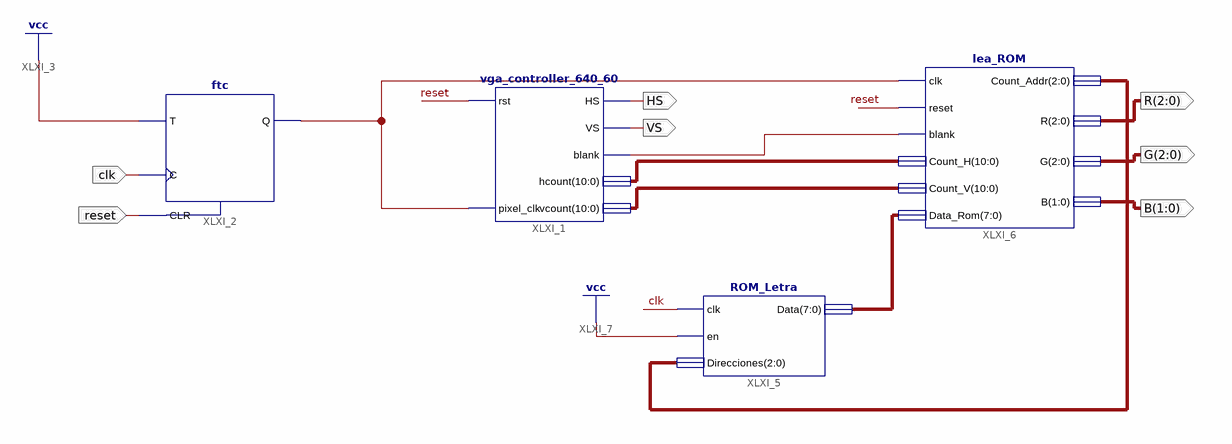
[diagram p0: schematic sheet 1]
// Xilinx ISE schematic VGA_Letras.sch (spartan3e) as structural Verilog: 4 symbols, 7 ports
module VGA_Letras (
  input  clk,
  input  reset,
  output HS,
  output VS,
  output [2:0] R,
  output [2:0] G,
  output [1:0] B
);

  wire XLXN_4, XLXN_13;
  wire [2:0] XLXN_24;
  wire [7:0] XLXN_17;
  wire [10:0] XLXN_6, XLXN_7;

  vga_controller_640_60 XLXI_1 (
    .rst(reset), .pixel_clk(XLXN_4), .HS(HS), .VS(VS), .blank(XLXN_13), .hcount(XLXN_6), .vcount(XLXN_7));
  ftc XLXI_2 (.C(clk), .CLR(reset), .T(1'b1), .Q(XLXN_4));
  ROM_Letra XLXI_5 (.clk(clk), .en(1'b1), .Direcciones(XLXN_24), .Data(XLXN_17));
  lea_ROM XLXI_6 (
    .clk(XLXN_4), .reset(reset), .blank(XLXN_13), .Count_H(XLXN_6), .Count_V(XLXN_7), .Data_Rom(XLXN_17),
    .Count_Addr(XLXN_24), .R(R), .G(G), .B(B));
endmodule
